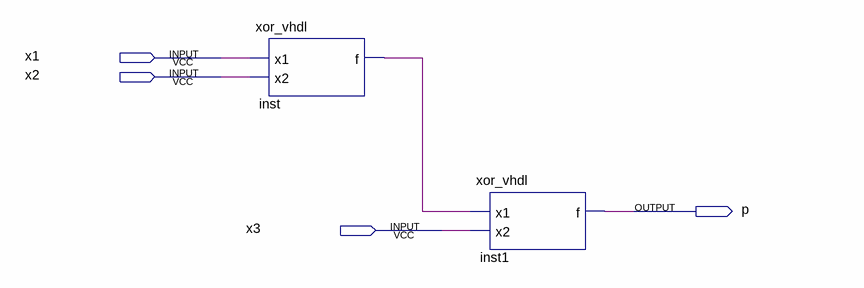
[diagram p0: schematic sheet]
// Quartus schematic paridade_herarquico.bdf as structural Verilog: 2 symbols, 4 pins
module paridade_herarquico (
  input  x1,
  input  x2,
  input  x3,
  output p
);

  wire inst_f;

  xor_vhdl inst (.x1(x1), .x2(x2), .f(inst_f));
  xor_vhdl inst1 (.x1(inst_f), .x2(x3), .f(p));
endmodule
